# Altium schematic sheet MAX96724_PINOUT.SchDoc
size D; SheetNumber: 2; SheetTotal: 4
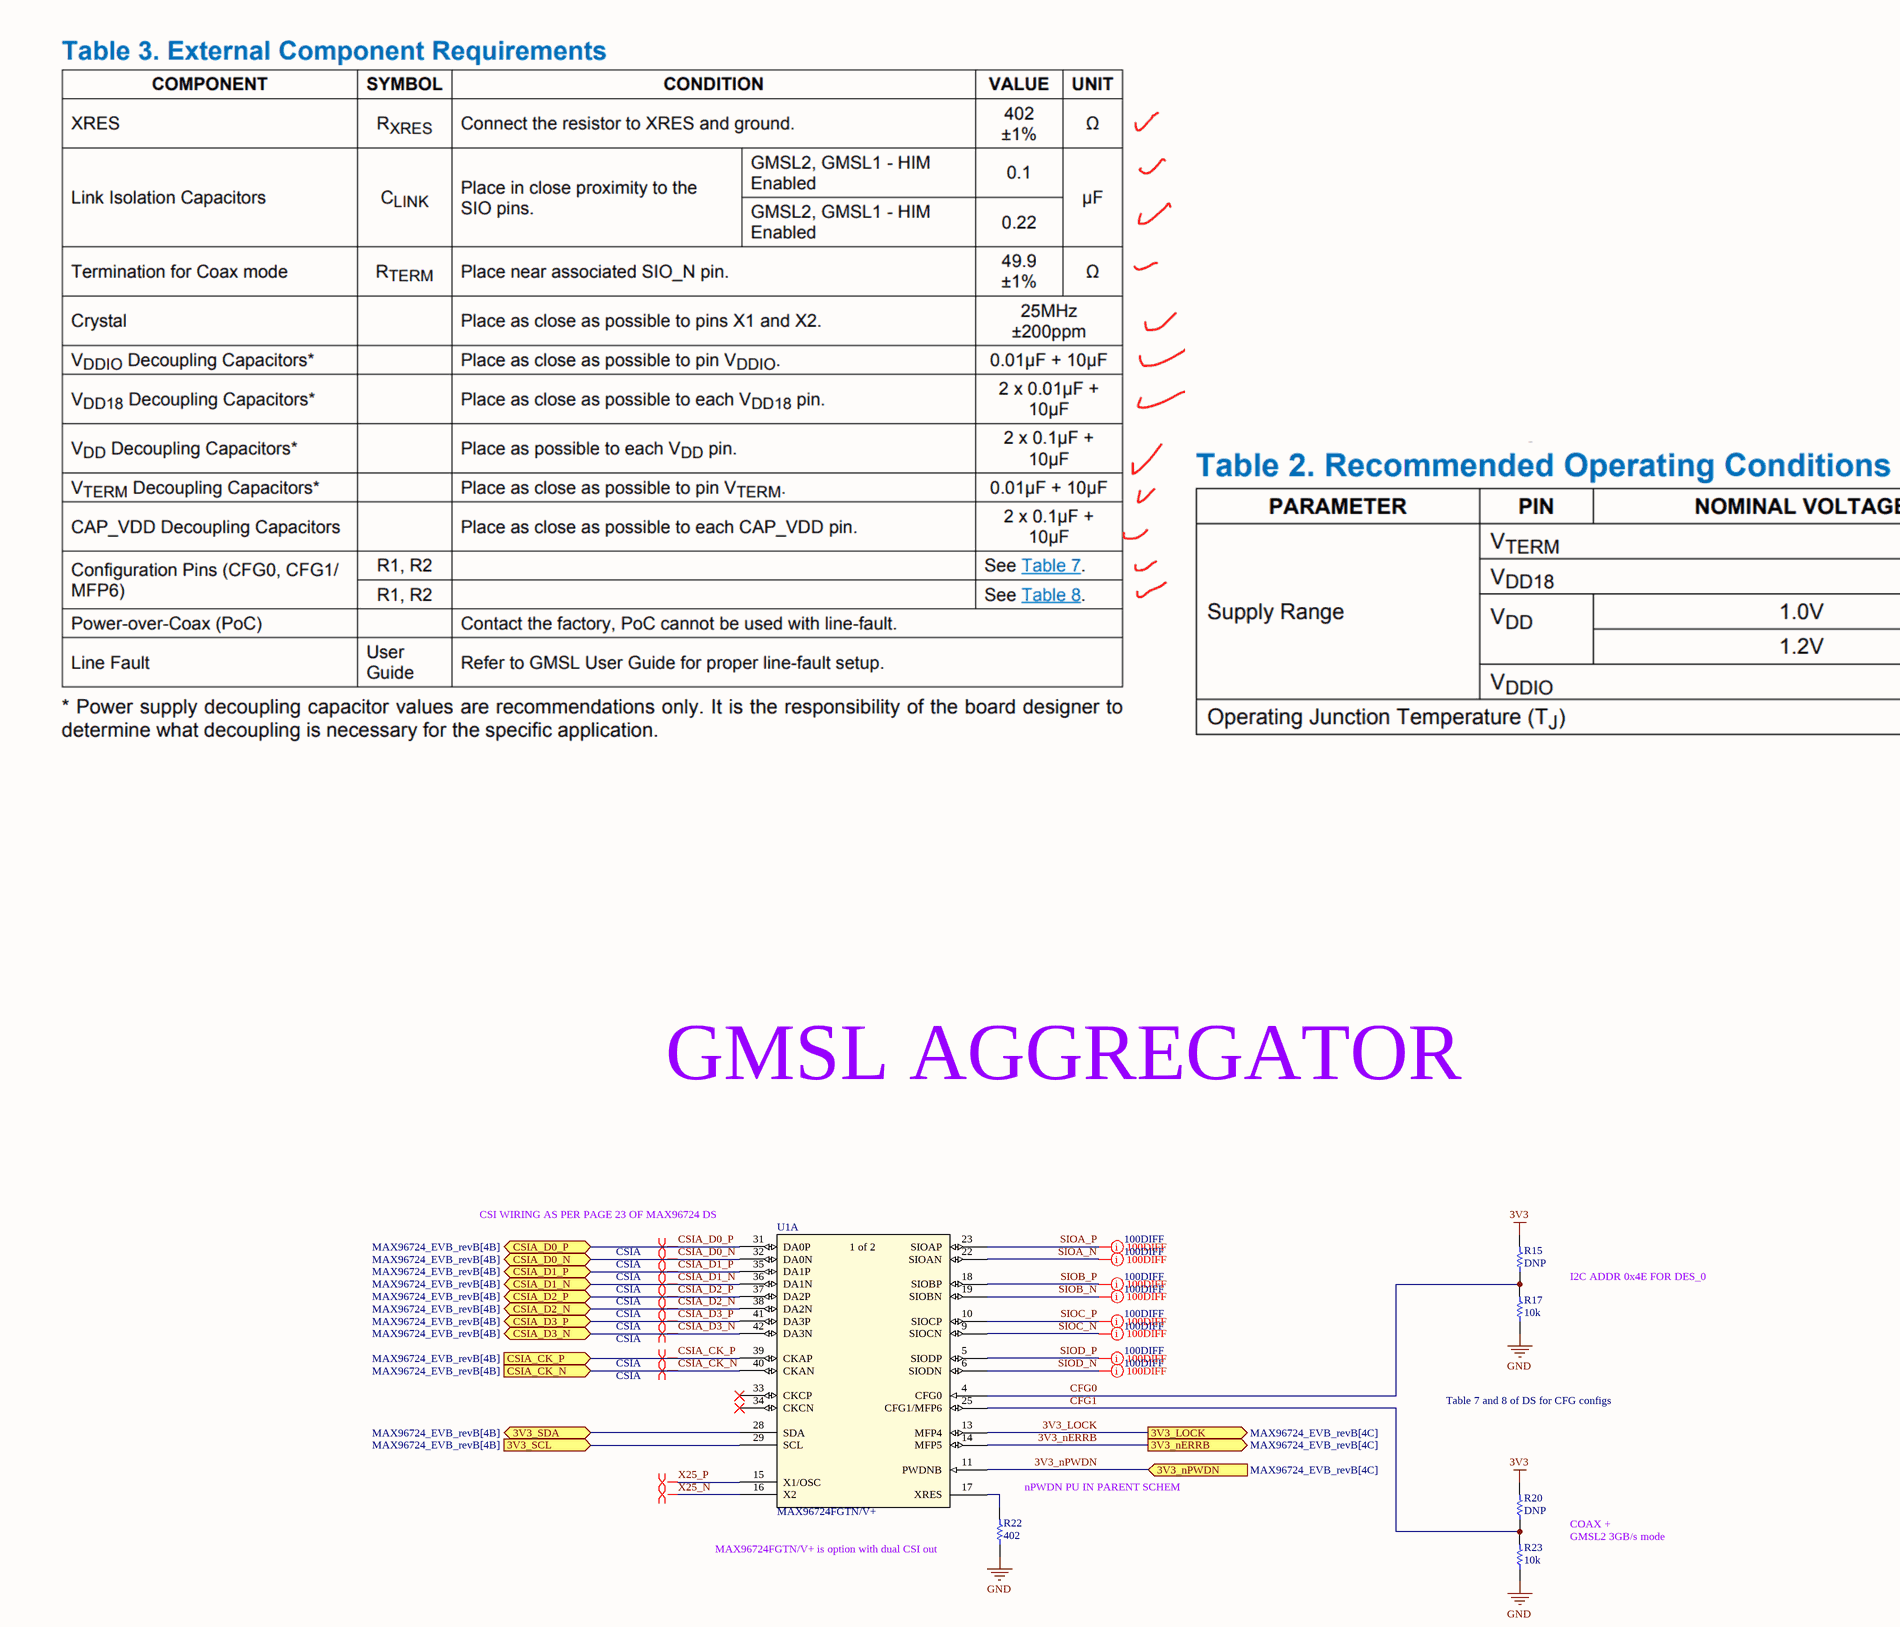
[diagram p0: MAX96724_PINOUT.SchDoc, top left]
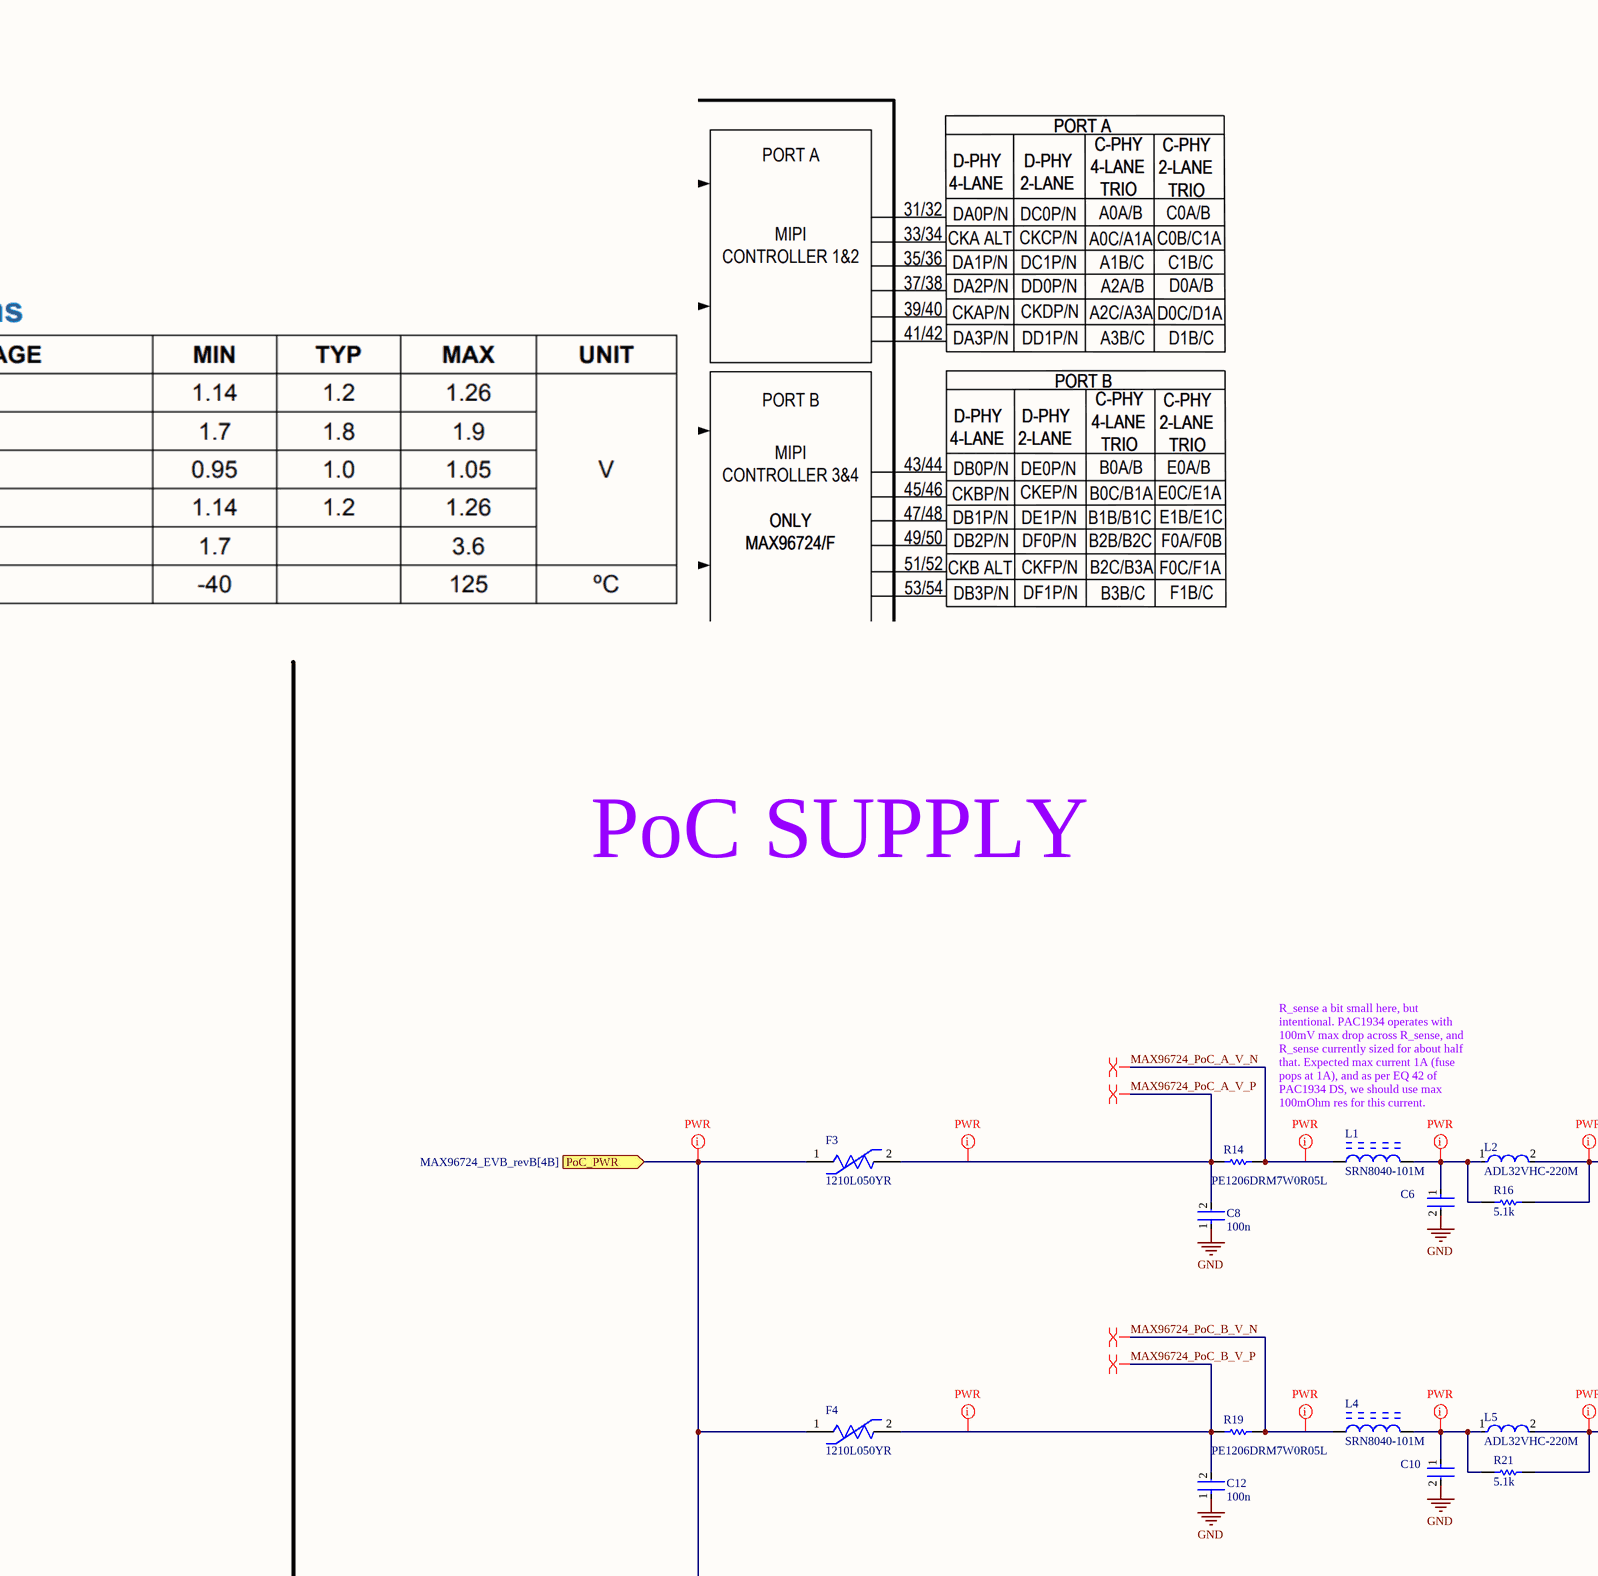
[diagram p1: MAX96724_PINOUT.SchDoc, top middle]
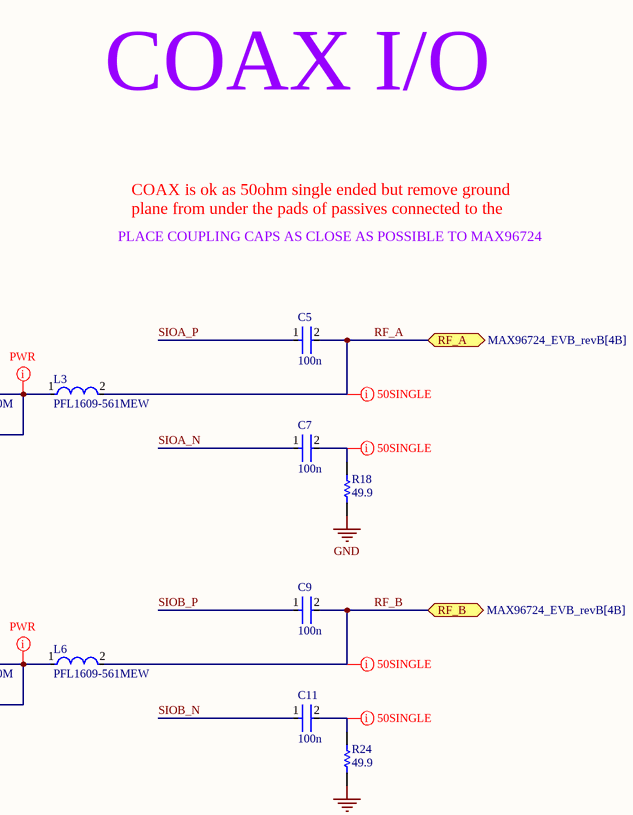
[diagram p2: MAX96724_PINOUT.SchDoc, top right]
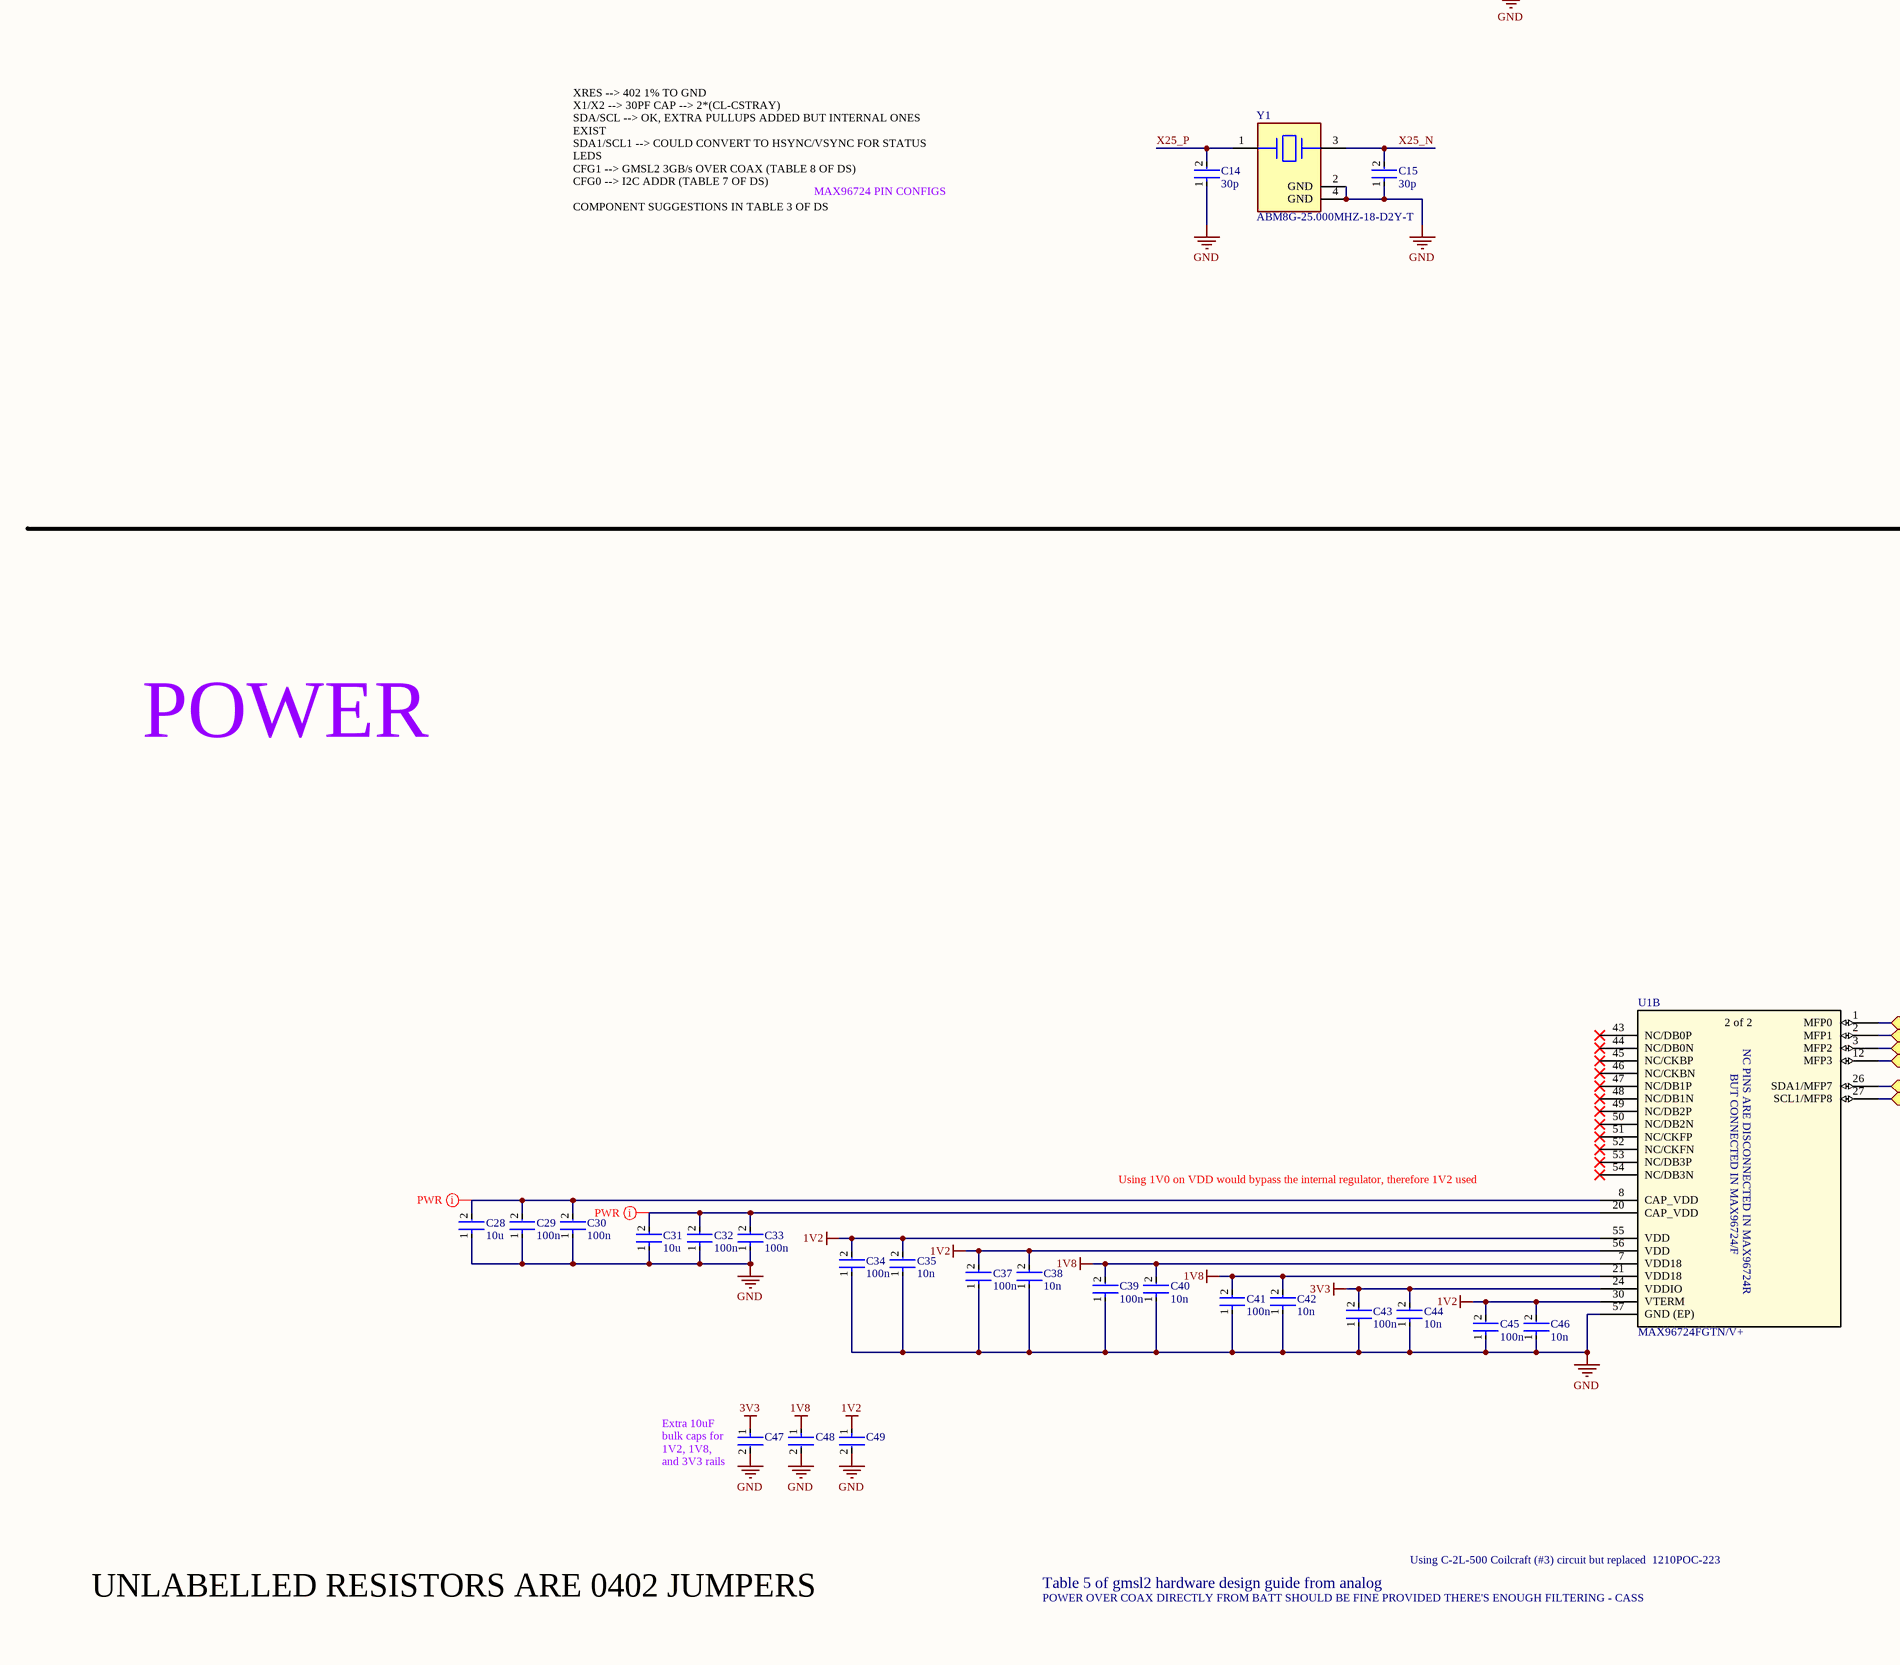
[diagram p3: MAX96724_PINOUT.SchDoc, bottom left]
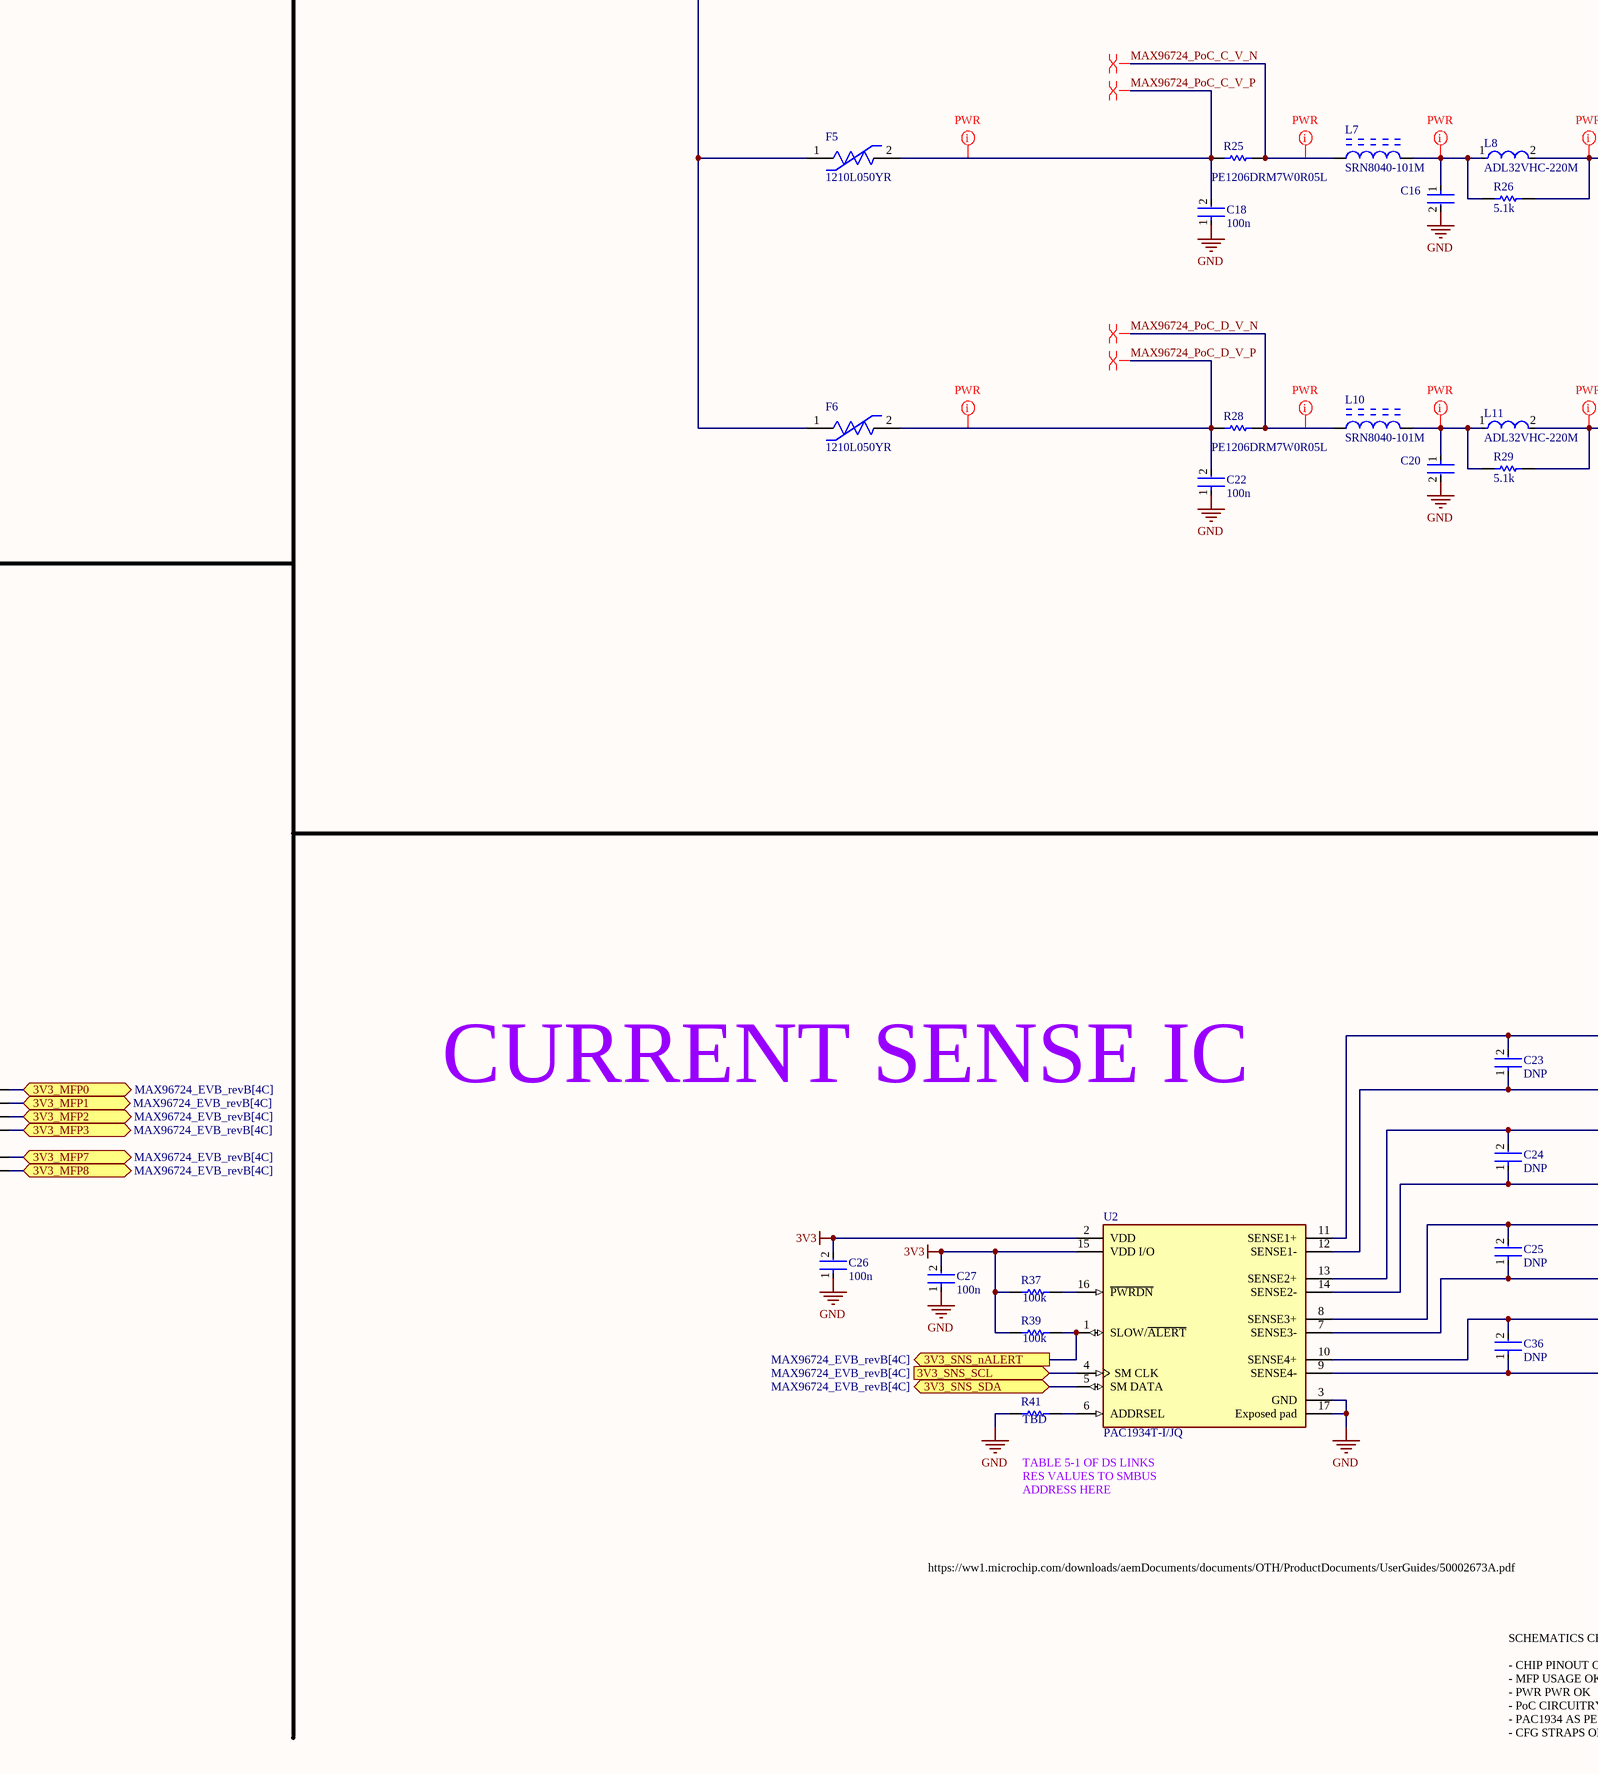
[diagram p4: MAX96724_PINOUT.SchDoc, bottom middle]
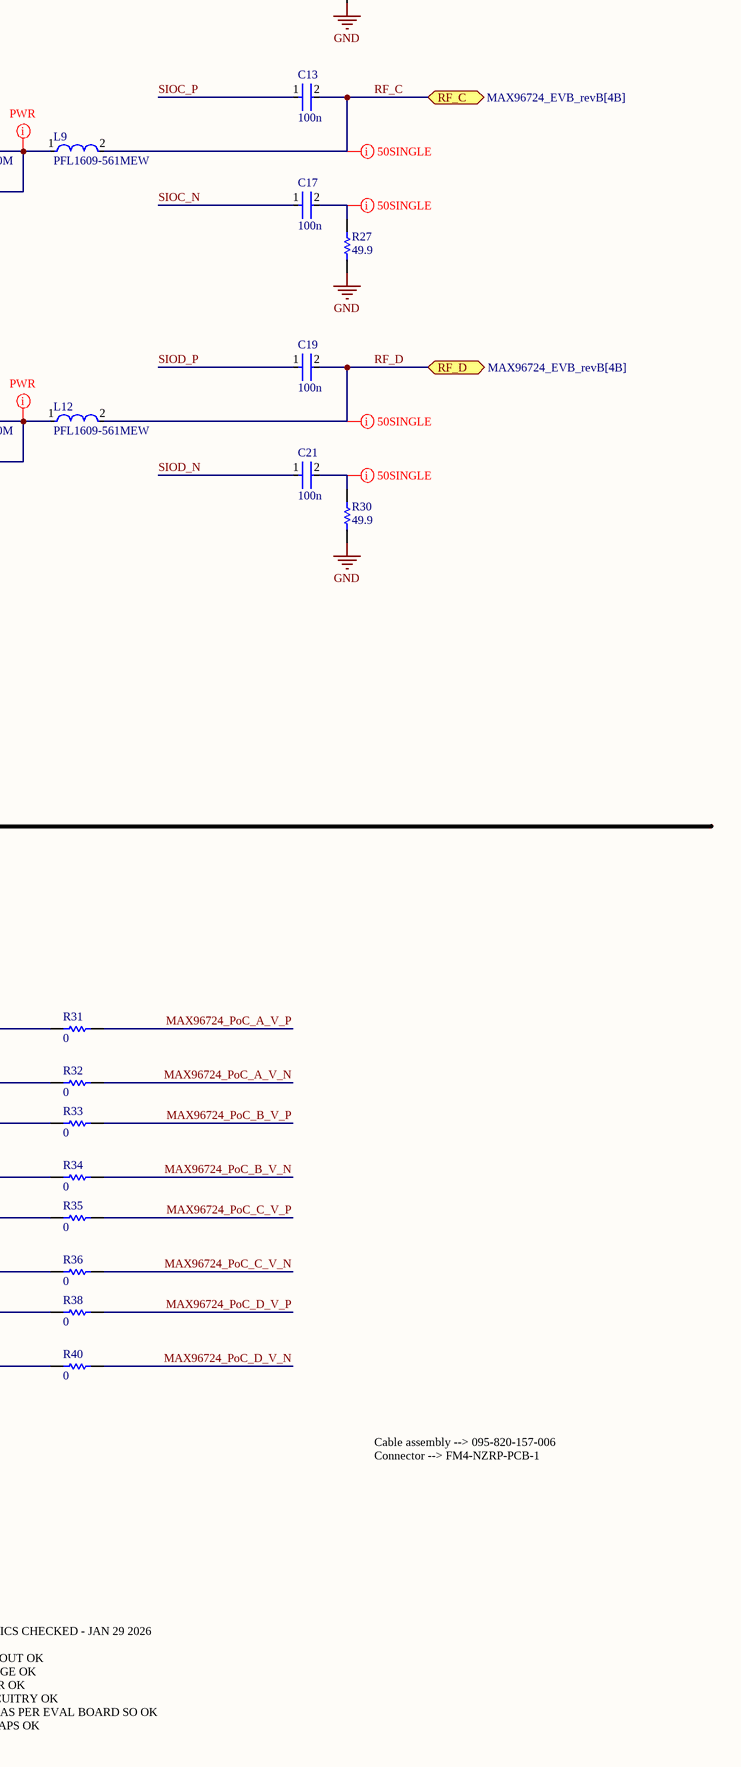
[diagram p5: MAX96724_PINOUT.SchDoc, bottom right]

## Parts
C5  100n  [FP-0402-L_1_0_0_05-W_0_5-IPC_A]
C6  GRM21BR61E226ME44L  [FP-GRM21B-0_2-e0_2_0_7-IPC_B]  (value not drawn)
C7  100n  [FP-0402-L_1_0_0_05-W_0_5-IPC_A]
C8  100n  [FP-0402-L_1_0_0_05-W_0_5-IPC_A]
C9  100n  [FP-0402-L_1_0_0_05-W_0_5-IPC_A]
C10  GRM21BR61E226ME44L  [FP-GRM21B-0_2-e0_2_0_7-IPC_B]  (value not drawn)
C11  100n  [FP-0402-L_1_0_0_05-W_0_5-IPC_A]
C12  100n  [FP-0402-L_1_0_0_05-W_0_5-IPC_A]
C13  100n  [FP-0402-L_1_0_0_05-W_0_5-IPC_A]
C14  30p  [FP-0402-L_1_0_0_05-W_0_5-IPC_A]
C15  30p  [FP-0402-L_1_0_0_05-W_0_5-IPC_A]
C16  GRM21BR61E226ME44L  [FP-GRM21B-0_2-e0_2_0_7-IPC_B]  (value not drawn)
C17  100n  [FP-0402-L_1_0_0_05-W_0_5-IPC_A]
C18  100n  [FP-0402-L_1_0_0_05-W_0_5-IPC_A]
C19  100n  [FP-0402-L_1_0_0_05-W_0_5-IPC_A]
C20  GRM21BR61E226ME44L  [FP-GRM21B-0_2-e0_2_0_7-IPC_B]  (value not drawn)
C21  100n  [FP-0402-L_1_0_0_05-W_0_5-IPC_A]
C22  100n  [FP-0402-L_1_0_0_05-W_0_5-IPC_A]
C23  DNP  [FP-0402-L_1_0_0_05-W_0_5-IPC_A]
C24  DNP  [FP-0402-L_1_0_0_05-W_0_5-IPC_A]
C25  DNP  [FP-0402-L_1_0_0_05-W_0_5-IPC_A]
C26  100n  [FP-0402-L_1_0_0_05-W_0_5-IPC_A]
C27  100n  [FP-0402-L_1_0_0_05-W_0_5-IPC_A]
C28  10u  [FP-0402-L_1_0_0_05-W_0_5-IPC_A]
C29  100n  [FP-0402-L_1_0_0_05-W_0_5-IPC_A]
C30  100n  [FP-0402-L_1_0_0_05-W_0_5-IPC_A]
C31  10u  [FP-0402-L_1_0_0_05-W_0_5-IPC_A]
C32  100n  [FP-0402-L_1_0_0_05-W_0_5-IPC_A]
C33  100n  [FP-0402-L_1_0_0_05-W_0_5-IPC_A]
C34  100n  [FP-0402-L_1_0_0_05-W_0_5-IPC_A]
C35  10n  [FP-0402-L_1_0_0_05-W_0_5-IPC_A]
C36  DNP  [FP-0402-L_1_0_0_05-W_0_5-IPC_A]
C37  100n  [FP-0402-L_1_0_0_05-W_0_5-IPC_A]
C38  10n  [FP-0402-L_1_0_0_05-W_0_5-IPC_A]
C39  100n  [FP-0402-L_1_0_0_05-W_0_5-IPC_A]
C40  10n  [FP-0402-L_1_0_0_05-W_0_5-IPC_A]
C41  100n  [FP-0402-L_1_0_0_05-W_0_5-IPC_A]
C42  10n  [FP-0402-L_1_0_0_05-W_0_5-IPC_A]
C43  100n  [FP-0402-L_1_0_0_05-W_0_5-IPC_A]
C44  10n  [FP-0402-L_1_0_0_05-W_0_5-IPC_A]
C45  100n  [FP-0402-L_1_0_0_05-W_0_5-IPC_A]
C46  10n  [FP-0402-L_1_0_0_05-W_0_5-IPC_A]
C47  EMK107BBJ106MA-T  [FP-0603-L_1_6_0_2-W_0_8_0-MFG]  (value not drawn)
C48  EMK107BBJ106MA-T  [FP-0603-L_1_6_0_2-W_0_8_0-MFG]  (value not drawn)
C49  EMK107BBJ106MA-T  [FP-0603-L_1_6_0_2-W_0_8_0-MFG]  (value not drawn)
F3  1210L050YR  [FP-1210L050YR-MFG]
F4  1210L050YR  [FP-1210L050YR-MFG]
F5  1210L050YR  [FP-1210L050YR-MFG]
F6  1210L050YR  [FP-1210L050YR-MFG]
L1  SRN8040-101M  [BOUR-SRN8040-101M_V]
L2  ADL32VHC-220M  [FP-1210POC-MFG]
L3  PFL1609-561MEW  [FP-PFL1609-MFG]
L4  SRN8040-101M  [BOUR-SRN8040-101M_V]
L5  ADL32VHC-220M  [FP-1210POC-MFG]
L6  PFL1609-561MEW  [FP-PFL1609-MFG]
L7  SRN8040-101M  [BOUR-SRN8040-101M_V]
L8  ADL32VHC-220M  [FP-1210POC-MFG]
L9  PFL1609-561MEW  [FP-PFL1609-MFG]
L10  SRN8040-101M  [BOUR-SRN8040-101M_V]
L11  ADL32VHC-220M  [FP-1210POC-MFG]
L12  PFL1609-561MEW  [FP-PFL1609-MFG]
R14  PE1206DRM7W0R05L  [R1206B]
R15  DNP  [R0603B]
R16  5.1k  [R0603B]
R17  10k  [R0603B]
R18  49.9  [R0603B]
R19  PE1206DRM7W0R05L  [R1206B]
R20  DNP  [R0603B]
R21  5.1k  [R0603B]
R22  402  [R0603B]
R23  10k  [R0603B]
R24  49.9  [R0603B]
R25  PE1206DRM7W0R05L  [R1206B]
R26  5.1k  [R0603B]
R27  49.9  [R0603B]
R28  PE1206DRM7W0R05L  [R1206B]
R29  5.1k  [R0603B]
R30  49.9  [R0603B]
R31  0  [R0603B]
R32  0  [R0603B]
R33  0  [R0603B]
R34  0  [R0603B]
R35  0  [R0603B]
R36  0  [R0603B]
R37  100k  [R0603B]
R38  0  [R0603B]
R39  100k  [R0603B]
R40  0  [R0603B]
R41  TBD  [R0603B]
U1  MAX96724FGTN/V+  [MAX96724FGTN_V+-Footprint-1]  (parts A,B of 2)
U2  PAC1934T-I/JQ  [FP-C04-257-MFG]
Y1  ABM8G-25.000MHZ-18-D2Y-T  [FP-ABM8G-MFG]

## Ports
3V3_LOCK (out, see MAX96724_EVB_revB[4C]), 3V3_MFP0 (bidir, see MAX96724_EVB_revB[4C]), 3V3_MFP1 (bidir, see MAX96724_EVB_revB[4C]), 3V3_MFP2 (bidir, see MAX96724_EVB_revB[4C]), 3V3_MFP3 (bidir, see MAX96724_EVB_revB[4C]), 3V3_MFP7 (bidir, see MAX96724_EVB_revB[4C]), 3V3_MFP8 (bidir, see MAX96724_EVB_revB[4C]), 3V3_nERRB (out, see MAX96724_EVB_revB[4C]), 3V3_nPWDN (in, see MAX96724_EVB_revB[4C]), 3V3_SCL (in, see MAX96724_EVB_revB[4B]), 3V3_SDA (bidir, see MAX96724_EVB_revB[4B]), 3V3_SNS_nALERT (out, see MAX96724_EVB_revB[4C]), 3V3_SNS_SCL (in, see MAX96724_EVB_revB[4C]), 3V3_SNS_SDA (bidir, see MAX96724_EVB_revB[4C]), CSIA_CK_N (in, see MAX96724_EVB_revB[4B]), CSIA_CK_P (in, see MAX96724_EVB_revB[4B]), CSIA_D0_N (bidir, see MAX96724_EVB_revB[4B]), CSIA_D0_P (bidir, see MAX96724_EVB_revB[4B]), CSIA_D1_N (bidir, see MAX96724_EVB_revB[4B]), CSIA_D1_P (bidir, see MAX96724_EVB_revB[4B]), CSIA_D2_N (bidir, see MAX96724_EVB_revB[4B]), CSIA_D2_P (bidir, see MAX96724_EVB_revB[4B]), CSIA_D3_N (bidir, see MAX96724_EVB_revB[4B]), CSIA_D3_P (bidir, see MAX96724_EVB_revB[4B]), PoC_PWR (in, see MAX96724_EVB_revB[4B]), RF_A (bidir, see MAX96724_EVB_revB[4B]), RF_B (bidir, see MAX96724_EVB_revB[4B]), RF_C (bidir, see MAX96724_EVB_revB[4B]), RF_D (bidir, see MAX96724_EVB_revB[4B])

## Nets
1V2: C34.2 C35.2 C37.2 C38.2 C45.2 C46.2 C49.1 U1.30(VTERM) U1.55(VDD) U1.56(VDD)
1V8: C39.2 C40.2 C41.2 C42.2 C48.1 U1.7(VDD18) U1.21(VDD18)
3V3: C26.2 C27.2 C43.2 C44.2 C47.1 R15.2 R20.2 R37.2 R39.2 U1.24(VDDIO) U2.2(VDD) U2.15(VDD_I/O)
GND: C6.2 C8.1 C10.2 C12.1 C14.1 C15.1 C16.2 C18.1 C20.2 C22.1 C26.1 C27.1 C28.1 C29.1 C30.1 C31.1 C32.1 C33.1 C34.1 C35.1 C37.1 C38.1 C39.1 C40.1 C41.1 C42.1 C43.1 C44.1 C45.1 C46.1 C47.2 C48.2 C49.2 R17.1 R18.1 R22.1 R23.1 R24.1 R27.1 R30.1 R41.2 U1.57(GND_(EP)) U2.3(GND) U2.17(Exposed_pad) Y1.2(GND) Y1.4(GND)
3V3_LOCK: U1.13(MFP4) ; port 3V3_LOCK
3V3_MFP0: U1.1(MFP0) ; port 3V3_MFP0
3V3_MFP1: U1.2(MFP1) ; port 3V3_MFP1
3V3_MFP2: U1.3(MFP2) ; port 3V3_MFP2
3V3_MFP3: U1.12(MFP3) ; port 3V3_MFP3
3V3_MFP7: U1.26(SDA1/MFP7) ; port 3V3_MFP7
3V3_MFP8: U1.27(SCL1/MFP8) ; port 3V3_MFP8
3V3_nERRB: U1.14(MFP5) ; port 3V3_nERRB
3V3_nPWDN: U1.11(PWDNB) ; port 3V3_nPWDN
3V3_SCL: U1.29(SCL) ; port 3V3_SCL
3V3_SDA: U1.28(SDA) ; port 3V3_SDA
3V3_SNS_nALERT: R39.1 U2.1(SLOW/~{ALERT}) ; port 3V3_SNS_nALERT
3V3_SNS_SCL: U2.4(SM_CLK) ; port 3V3_SNS_SCL
3V3_SNS_SDA: U2.5(SM_DATA) ; port 3V3_SNS_SDA
CFG0: R15.1 R17.2 U1.4(CFG0)
CFG1: R20.1 R23.2 U1.25(CFG1/MFP6)
CSIA_CK_N: U1.40(CKAN) ; port CSIA_CK_N
CSIA_CK_P: U1.39(CKAP) ; port CSIA_CK_P
CSIA_D0_N: U1.32(DA0N) ; port CSIA_D0_N
CSIA_D0_P: U1.31(DA0P) ; port CSIA_D0_P
CSIA_D1_N: U1.36(DA1N) ; port CSIA_D1_N
CSIA_D1_P: U1.35(DA1P) ; port CSIA_D1_P
CSIA_D2_N: U1.38(DA2N) ; port CSIA_D2_N
CSIA_D2_P: U1.37(DA2P) ; port CSIA_D2_P
CSIA_D3_N: U1.42(DA3N) ; port CSIA_D3_N
CSIA_D3_P: U1.41(DA3P) ; port CSIA_D3_P
MAX96724_PoC_A_V_N: L1.1 R14.1 R32.1
MAX96724_PoC_A_V_P: C8.2 F3.2 R14.2 R31.1
MAX96724_PoC_B_V_N: L4.1 R19.1 R34.1
MAX96724_PoC_B_V_P: C12.2 F4.2 R19.2 R33.1
MAX96724_PoC_C_V_N: L7.1 R25.1 R36.1
MAX96724_PoC_C_V_P: C18.2 F5.2 R25.2 R35.1
MAX96724_PoC_D_V_N: L10.1 R28.1 R40.1
MAX96724_PoC_D_V_P: C22.2 F6.2 R28.2 R38.1
PoC_PWR: F3.1 F4.1 F5.1 F6.1 ; port PoC_PWR
RF_A: C5.2 L3.2 ; port RF_A
RF_B: C9.2 L6.2 ; port RF_B
RF_C: C13.2 L9.2 ; port RF_C
RF_D: C19.2 L12.2 ; port RF_D
SIOA_N: C7.1 U1.22(SIOAN)
SIOA_P: C5.1 U1.23(SIOAP)
SIOB_N: C11.1 U1.19(SIOBN)
SIOB_P: C9.1 U1.18(SIOBP)
SIOC_N: C17.1 U1.9(SIOCN)
SIOC_P: C13.1 U1.10(SIOCP)
SIOD_N: C21.1 U1.6(SIODN)
SIOD_P: C19.1 U1.5(SIODP)
X25_N: C15.2 U1.16(X2) Y1.3
X25_P: C14.2 U1.15(X1/OSC) Y1.1
NetC6_1: C6.1 L1.2 L2.1 R16.2
NetC7_2: C7.2 R18.2
NetC10_1: C10.1 L4.2 L5.1 R21.2
NetC11_2: C11.2 R24.2
NetC16_1: C16.1 L7.2 L8.1 R26.2
NetC17_2: C17.2 R27.2
NetC20_1: C20.1 L10.2 L11.1 R29.2
NetC21_2: C21.2 R30.2
NetC23_1: C23.1 R32.2 U2.12(SENSE1-)
NetC23_2: C23.2 R31.2 U2.11(SENSE1+)
NetC24_1: C24.1 R34.2 U2.14(SENSE2-)
NetC24_2: C24.2 R33.2 U2.13(SENSE2+)
NetC25_1: C25.1 R36.2 U2.7(SENSE3-)
NetC25_2: C25.2 R35.2 U2.8(SENSE3+)
NetC28_2: C28.2 C29.2 C30.2 U1.8(CAP_VDD)
NetC31_2: C31.2 C32.2 C33.2 U1.20(CAP_VDD)
NetC36_1: C36.1 R40.2 U2.9(SENSE4-)
NetC36_2: C36.2 R38.2 U2.10(SENSE4+)
NetL2_2: L2.2 L3.1 R16.1
NetL5_2: L5.2 L6.1 R21.1
NetL8_2: L8.2 L9.1 R26.1
NetL11_2: L11.2 L12.1 R29.1
NetR22_2: R22.2 U1.17(XRES)
NetR37_1: R37.1 U2.16(~{PWRDN})
NetR41_1: R41.1 U2.6(ADDRSEL)

Not connected (* = marked no-connect by the designer): U1 33(CKCP)* 34(CKCN)* 43(NC/DB0P)* 44(NC/DB0N)* 45(NC/CKBP)* 46(NC/CKBN)* 47(NC/DB1P)* 48(NC/DB1N)* 49(NC/DB2P)* 50(NC/DB2N)* 51(NC/CKFP)* 52(NC/CKFN)* 53(NC/DB3P)* 54(NC/DB3N)*

## Layout directives
net class 50SINGLE: NetC7_2, NetC11_2, NetC17_2, NetC21_2, RF_A, RF_B, RF_C, RF_D
differential pair: MAX96724_PoC_A_V_N, MAX96724_PoC_A_V_P, MAX96724_PoC_B_V_N, MAX96724_PoC_B_V_P, MAX96724_PoC_C_V_N, MAX96724_PoC_C_V_P, MAX96724_PoC_D_V_N, MAX96724_PoC_D_V_P, X25_N, X25_P
net class PWR: MAX96724_PoC_A_V_N, MAX96724_PoC_A_V_P, MAX96724_PoC_B_V_N, MAX96724_PoC_B_V_P, MAX96724_PoC_C_V_N, MAX96724_PoC_C_V_P, MAX96724_PoC_D_V_N, MAX96724_PoC_D_V_P, NetC6_1, NetC10_1, NetC16_1, NetC20_1, NetC28_2, NetC31_2, NetL2_2, NetL5_2, NetL8_2, NetL11_2, PoC_PWR
differential pair; differential pair class 100DIFF: SIOA_N, SIOA_P, SIOB_N, SIOB_P, SIOC_N, SIOC_P, SIOD_N, SIOD_P
differential pair; differential pair class CSIA: CSIA_CK_N, CSIA_CK_P, CSIA_D0_N, CSIA_D0_P, CSIA_D1_N, CSIA_D1_P, CSIA_D2_N, CSIA_D2_P, CSIA_D3_N, CSIA_D3_P

## Notes on the sheet
- PoC SUPPLY
- COAX I/O
- GMSL AGGREGATOR
- PLACE COUPLING CAPS AS CLOSE AS POSSIBLE TO MAX96724
- COAX is ok as 50ohm single ended but remove ground plane from under the pads of passives connected to the GMSL trace
- R_sense a bit small here, but intentional. PAC1934 operates with 100mV max drop across R_sense, and R_sense currently sized for about half that. Expected max current 1A (fuse pops at 1A), and as per EQ 42 of PAC1934 DS, we should use max 100mOhm res for this current.
- CSI WIRING AS PER PAGE 23 OF MAX96724 DS
- I2C ADDR 0x4E FOR DES_0
- Table 7 and 8 of DS for CFG configs
- (near R22) nPWDN PU IN PARENT SCHEM
- MAX96724FGTN/V+ is option with dual CSI out
- GMSL2 3GB/s mode
- COAX +
- XRES --> 402 1% TO GND
  X1/X2 --> 30PF CAP --> 2*(CL-CSTRAY)
  SDA/SCL --> OK, EXTRA PULLUPS ADDED BUT INTERNAL ONES EXIST
  SDA1/SCL1 --> COULD CONVERT TO HSYNC/VSYNC FOR STATUS LEDS
  CFG1 --> GMSL2 3GB/s OVER COAX (TABLE 8 OF DS)
  CFG0 --> I2C ADDR (TABLE 7 OF DS)
  COMPONENT SUGGESTIONS IN TABLE 3 OF DS
  - DECOUPLING CAPS OK
- MAX96724 PIN CONFIGS
- POWER
- CURRENT SENSE IC
- Using 1V0 on VDD would bypass the internal regulator, therefore 1V2 used
- TABLE 5-1 OF DS LINKS RES VALUES TO SMBUS ADDRESS HERE
- (near C47) Extra 10uF bulk caps for 1V2, 1V8, and 3V3 rails
- https://ww1.microchip.com/downloads/aemDocuments/documents/OTH/ProductDocuments/UserGuides/50002673A.pdf
- Cable assembly --> 095-820-157-006
  Connector --> FM4-NZRP-PCB-1
- Using C-2L-500 Coilcraft (#3) circuit but replaced  1210POC-223
- UNLABELLED RESISTORS ARE 0402 JUMPERS
- Table 5 of gmsl2 hardware design guide from analog
- POWER OVER COAX DIRECTLY FROM BATT SHOULD BE FINE PROVIDED THERE'S ENOUGH FILTERING - CASS
- SCHEMATICS CHECKED - JAN 29 2026
  - CHIP PINOUT OK
  - MFP USAGE OK
  - PWR PWR OK
  - PoC CIRCUITRY OK
  - PAC1934 AS PER EVAL BOARD SO OK
  - CFG STRAPS OK
- (in symbol CMP-015-00011-4, part A) 1 of 2
- (in symbol CMP-015-00011-4, part B) 2 of 2; NC PINS ARE DISCONNECTED IN MAX96724R; BUT CONNECTED IN MAX96724/F

## Library data of the parts
C5 C7-C9 C11-C15 C17-C19 C21-C46 = CMP-001-00058-1: LARGE PADS, 0402 CAP, CHANGE COMMENT TO MATCH REAL P/N; Capacitor Type: Ceramic; Min Operating Temperature: -55°C; Mounting Technology: Surface Mount; Pins: 2; Case/Package: 0402; RoHS Compliant: Yes; Max Operating Temperature: 85°C
C6 C10 C16 C20 = CMP-2007-03222-3: Chip Multilayer Ceramic Capacitors for General Purpose, 0805, 22uF, X5R, 15%, 20%, 25V; Case/Package: 0805; Depth: 1.25mm; Resistor Type: Ceramic; Voltage Rating: 25V; Lead Free: Lead Free; Voltage Rating (DC): 25V; Case Code (Metric): 2012; Thickness: 0.057inch; REACH SVHC: No SVHC; Material: Ceramic; Tolerance: 20%; Length: 2mm; Capacitance: 22uF; Case Code (Imperial): 0805; Max Operating Temperature: 85°C; Termination: SMD/SMT; Weight: 0.000335oz; Dielectric: X5R; Packaging: Tape and Reel; Voltage: 25V; Package Quantity: 3000; Height: 1.25mm; Mount: Surface Mount; Width: 1.25mm; Min Operating Temperature: -55°C
C47-C49 = CMP-2000-06226-4: Multilayer Ceramic Capacitor 10uF 16V X5R 20% SMD 0603 T/R; Packaging: Tape and Reel; Construction: Flat; Height: 0.8mm; Max Operating Temperature: 85°C; Dielectric: X5R; Case Code (Metric): 1608; Voltage Rating (DC): 16V; Width: 0.031inch; Voltage Rating: 16V; Length: 0.063inch; RoHS Compliant: Yes; Halogen Free: Halogen Free; Case Code (Imperial): 0603; Capacitance: 10uF; Mount: Surface Mount; Thickness: 0.031inch; Tolerance: 20%; Min Operating Temperature: -55°C; Series: M; Termination: SMD/SMT; Case/Package: 0603; Package Quantity: 1
F3-F6 = CMP-08606-000067-1: PTC RESET FUSE 13.2V 500MA 1210; Approvals: cULus; Resistance: 900mR; Time to Trip: 0.1s; Max Current Rating: 100A; Trip Current: 1A; Max Power Dissipation: 600mW; Case Code (Metric): 3225; Min Operating Temperature: -40°C; Max Voltage Rating (DC): 13.2V; Hold Current: 500mA; Working Voltage: 13.2V; Termination: SMD/SMT; Case Code (Imperial): 1210; Current Rating: 100A; REACH SVHC: No SVHC; Width: 2.8mm; Lead Free: Lead Free; Length: 3.43mm; Voltage Rating (DC): 13.2V; Packaging: Tape and Reel; Terminal Material: Copper; Voltage Rating: 13.2V; Height: 0.85mm; Case/Package: 1210; Package Quantity: 4000; Max Operating Temperature: 85°C; Power Dissipation: 600mW; Operating Supply Voltage: 13.2V
L1 L4 L7 L10 = CMP-2000-07143-1: Semi-Shielded Power Inductor, 100 uH, -40 to 125 degC, 2-Pin SMD, RoHS, Tape and Reel; Manufacturer: Bourns; Tolerance: ±20 / %; Brand/Series: SRN8040Series; Current, Rating: 1 / A; Inductance: 100 / µH; Manufacturer URL: http://www.bourns.com/; Package Description: 2-Pin Surface Mount Device, Body 8 x 8 mm; Datasheet URL: http://www.produktinfo.conrad.com/datenblaetter/1000000-1099999/001056456-da-01-en-MAG_ABG_LEIST_IND_SRN8040_101M_100UH_SMD.pdf; Datasheet Version: 08/2013; Termination: SMT; Type: Power; Mounting Technology: SurfaceMount; Package Reference: SRN8040-101M
L2 L5 L8 L11 = CMP-11268-000041-1: NOT COILCRAFT - ACTUAL P# --> ADL32VHC-220M / - Power Injection Chokes for PoC; Manufacturer Part Number: 1210POC-223MRC; Value: 22uH; Core Material: Ferrite; Saturation Current: 720mA; Series Resistance: 0.88Ω; Rms Current: 700mA; Automotive Grade: Grade 1; Self Resonant Frequency: 70MHz; Test Frequency: 100kHz; Tolerance: 20%; Ambient Temperature Range High: +125°C; Manufacturer: coilcraft; Octopart: https://octopart.com/1210poc-223mrc-coilcraft-103207315; Category: Ind; Device Class L2: Inductors; RoHS: TRUE; Device Class L3: Fixed Inductors; Package: 1210POC; Ambient Temperature Range Low: -40°C; ComponentLink2URL: https://drive.google.com/open?id=15FlOq8Y4YbRFohfA_cJ40jgnqs8va2Mh; Lead Free: Yes; Inductance: 22uH; Device Class L1: Passive Components; ComponentLink2Description: Datasheet; Automotive: Yes; Height: 3mm
L3 L6 L9 L12 = CMP-11268-000007-1: Fixed Inductors PFL1609 Low Profile 0.56 uH 20 % 1.4 A; Manufacturer: coilcraft; Rms Current: 1100mA; Self Resonant Frequency: 600MHz; Core Material: Composite; Tolerance: 20%; Value: 0.56uH; Automotive Grade: Grade 1; Saturation Current: 710mA; Test Frequency: 7.9MHz; Shielding: true; Series Resistance: 130mΩ; Lead Free: Yes; Device Class L1: Passive Components; Package: PFL1609; Octopart: https://octopart.com/pfl1609-561mew-coilcraft-20329171; ComponentLink2URL: https://www.coilcraft.com/pdfs/pfl1609.pdf; Manufacturer Part Number: PFL1609-561MEW; Ambient Temperature Range Low: -40°C; Composition: Wirewound; Inductance: 0.56uH; Device Class L2: Inductors; Category: Ind; Device Class L3: Fixed Inductors; Mouser Description: Fixed Inductors PFL1609 Low Profile 0.56 uH 20 % 1.4 A; Automotive: Yes; ComponentLink2Description: Datasheet; Ambient Temperature Range High: +105°C; Height: 0.95mm; RoHS: TRUE
R14 R19 R25 R28 = CMP-009-00002-14: Value: 100k
R15-R18 R20-R24 R26 R27 R29-R40 = CMP-009-00002-14: Resistor
  R31-R36 R38 R40: Value: 0
  R37 R39: Value: 100k
R41 = CMP-009-00002-14: Resistor; Value: 100k
U1 = CMP-015-00011-4: Quad Tunneling GMSL2/1 to CSI-2 Deserializer
U2 = CMP-06317-000025-1: QUAD HIGH-SIDE CURRENT SENSOR; Accuracy: 1%; Min Operating Temperature: -40°C; Mount: Surface Mount; Max Operating Temperature: 85°C; Packaging: Cut Tape; RoHS Compliant: No
Y1 = CMP-2000-05733-3: Crystal 25MHz ±20ppm (Tol) ±30ppm (Stability) 18pF FUND 60Ω 4-Pin SMD T/R; Series Resistance: 60R; Length: 3.2mm; Depth: 2.5mm; Packaging: Tape and Reel; Min Operating Temperature: -40°C; Operating Frequency: 25 MHz; Lead Free: Lead Free; Number of Pins: 4; Frequency Tolerance: 20ppm; Radiation Hardening: No; Max Operating Temperature: 85°C; Termination: SMD/SMT; Frequency Stability: 30ppm; Frequency: 25MHz; Series: ABM8G; Mount: Surface Mount; Package Quantity: 1000; Height: 0.039inch; Width: 0.098inch; Case/Package: CSMD; ESR (Equivalent Series Resistance): 60R; Load Capacitance: 18pF; Tolerance: 20ppm